# EasyEDA schematic SCH_sensors_2026-05-03.json

## Sheets
1 esp32: TITLE: Sheet_1; REV: 1.0; Date: 2026-04-29; Sheet: 1/1; Drawn By: milenamayilyan5; Company: Your Company
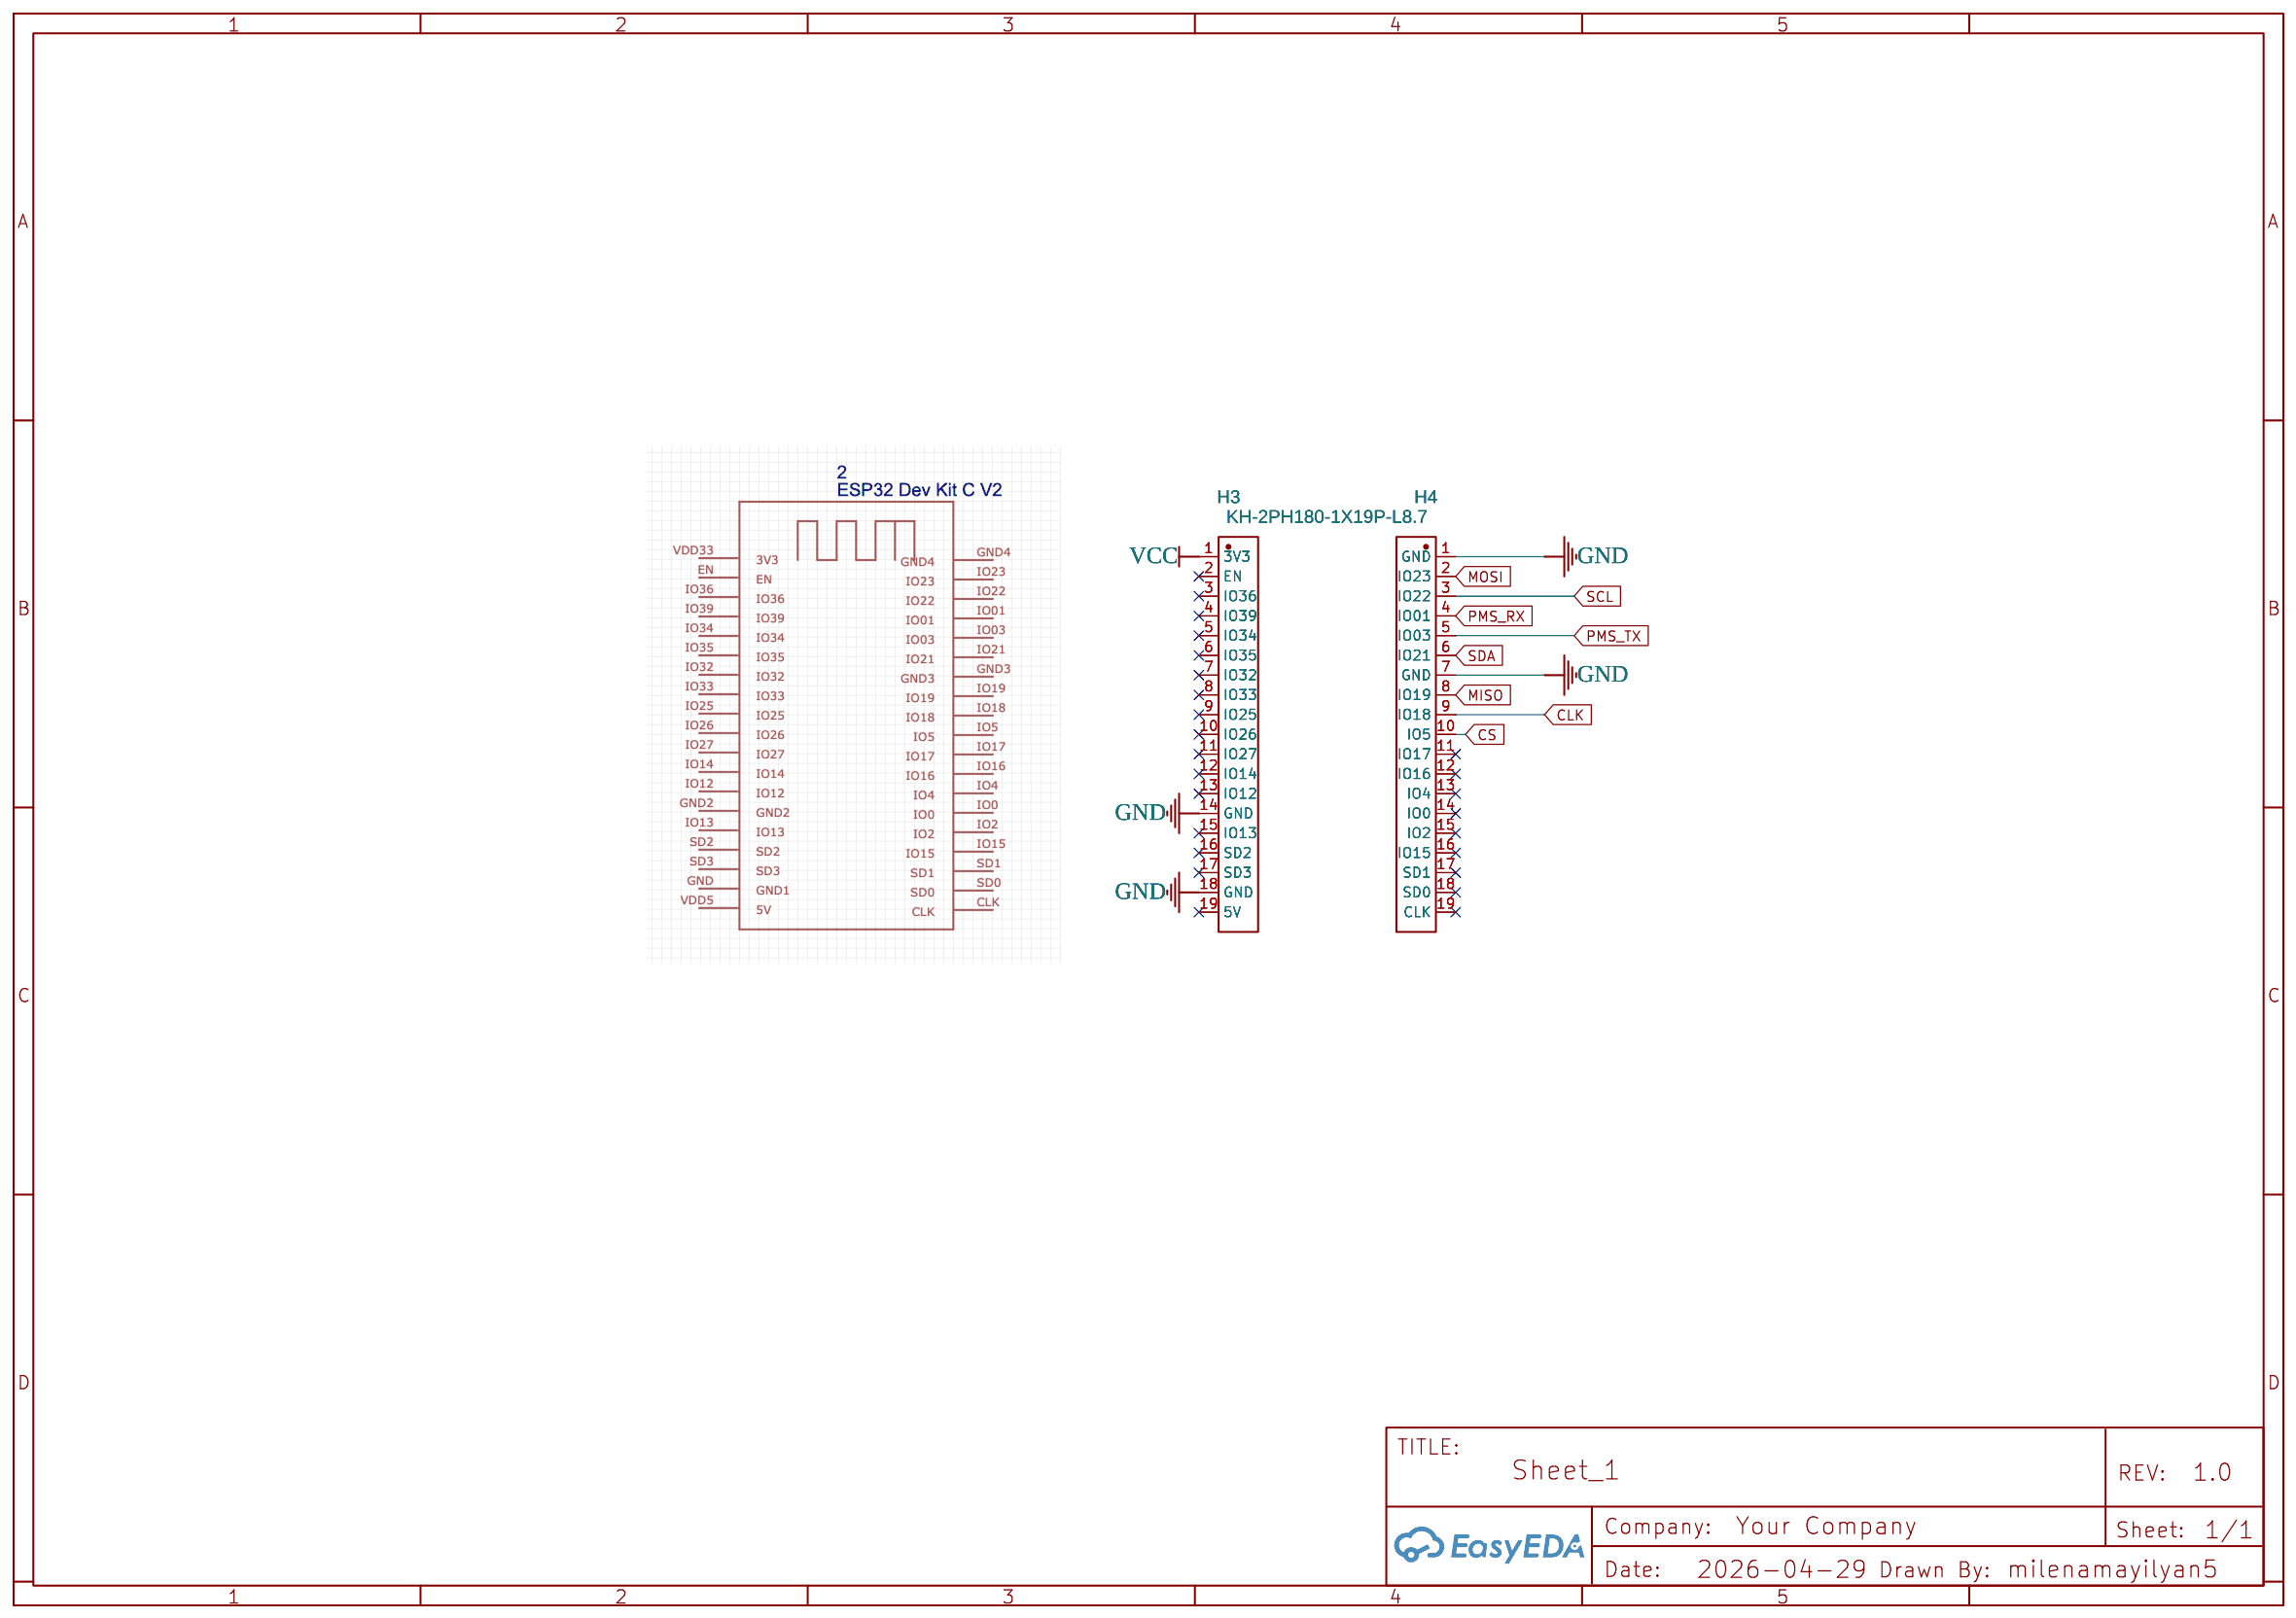
[diagram p0: esp32]
2 booster: TITLE: Sheet_2; Date: 2026-05-03
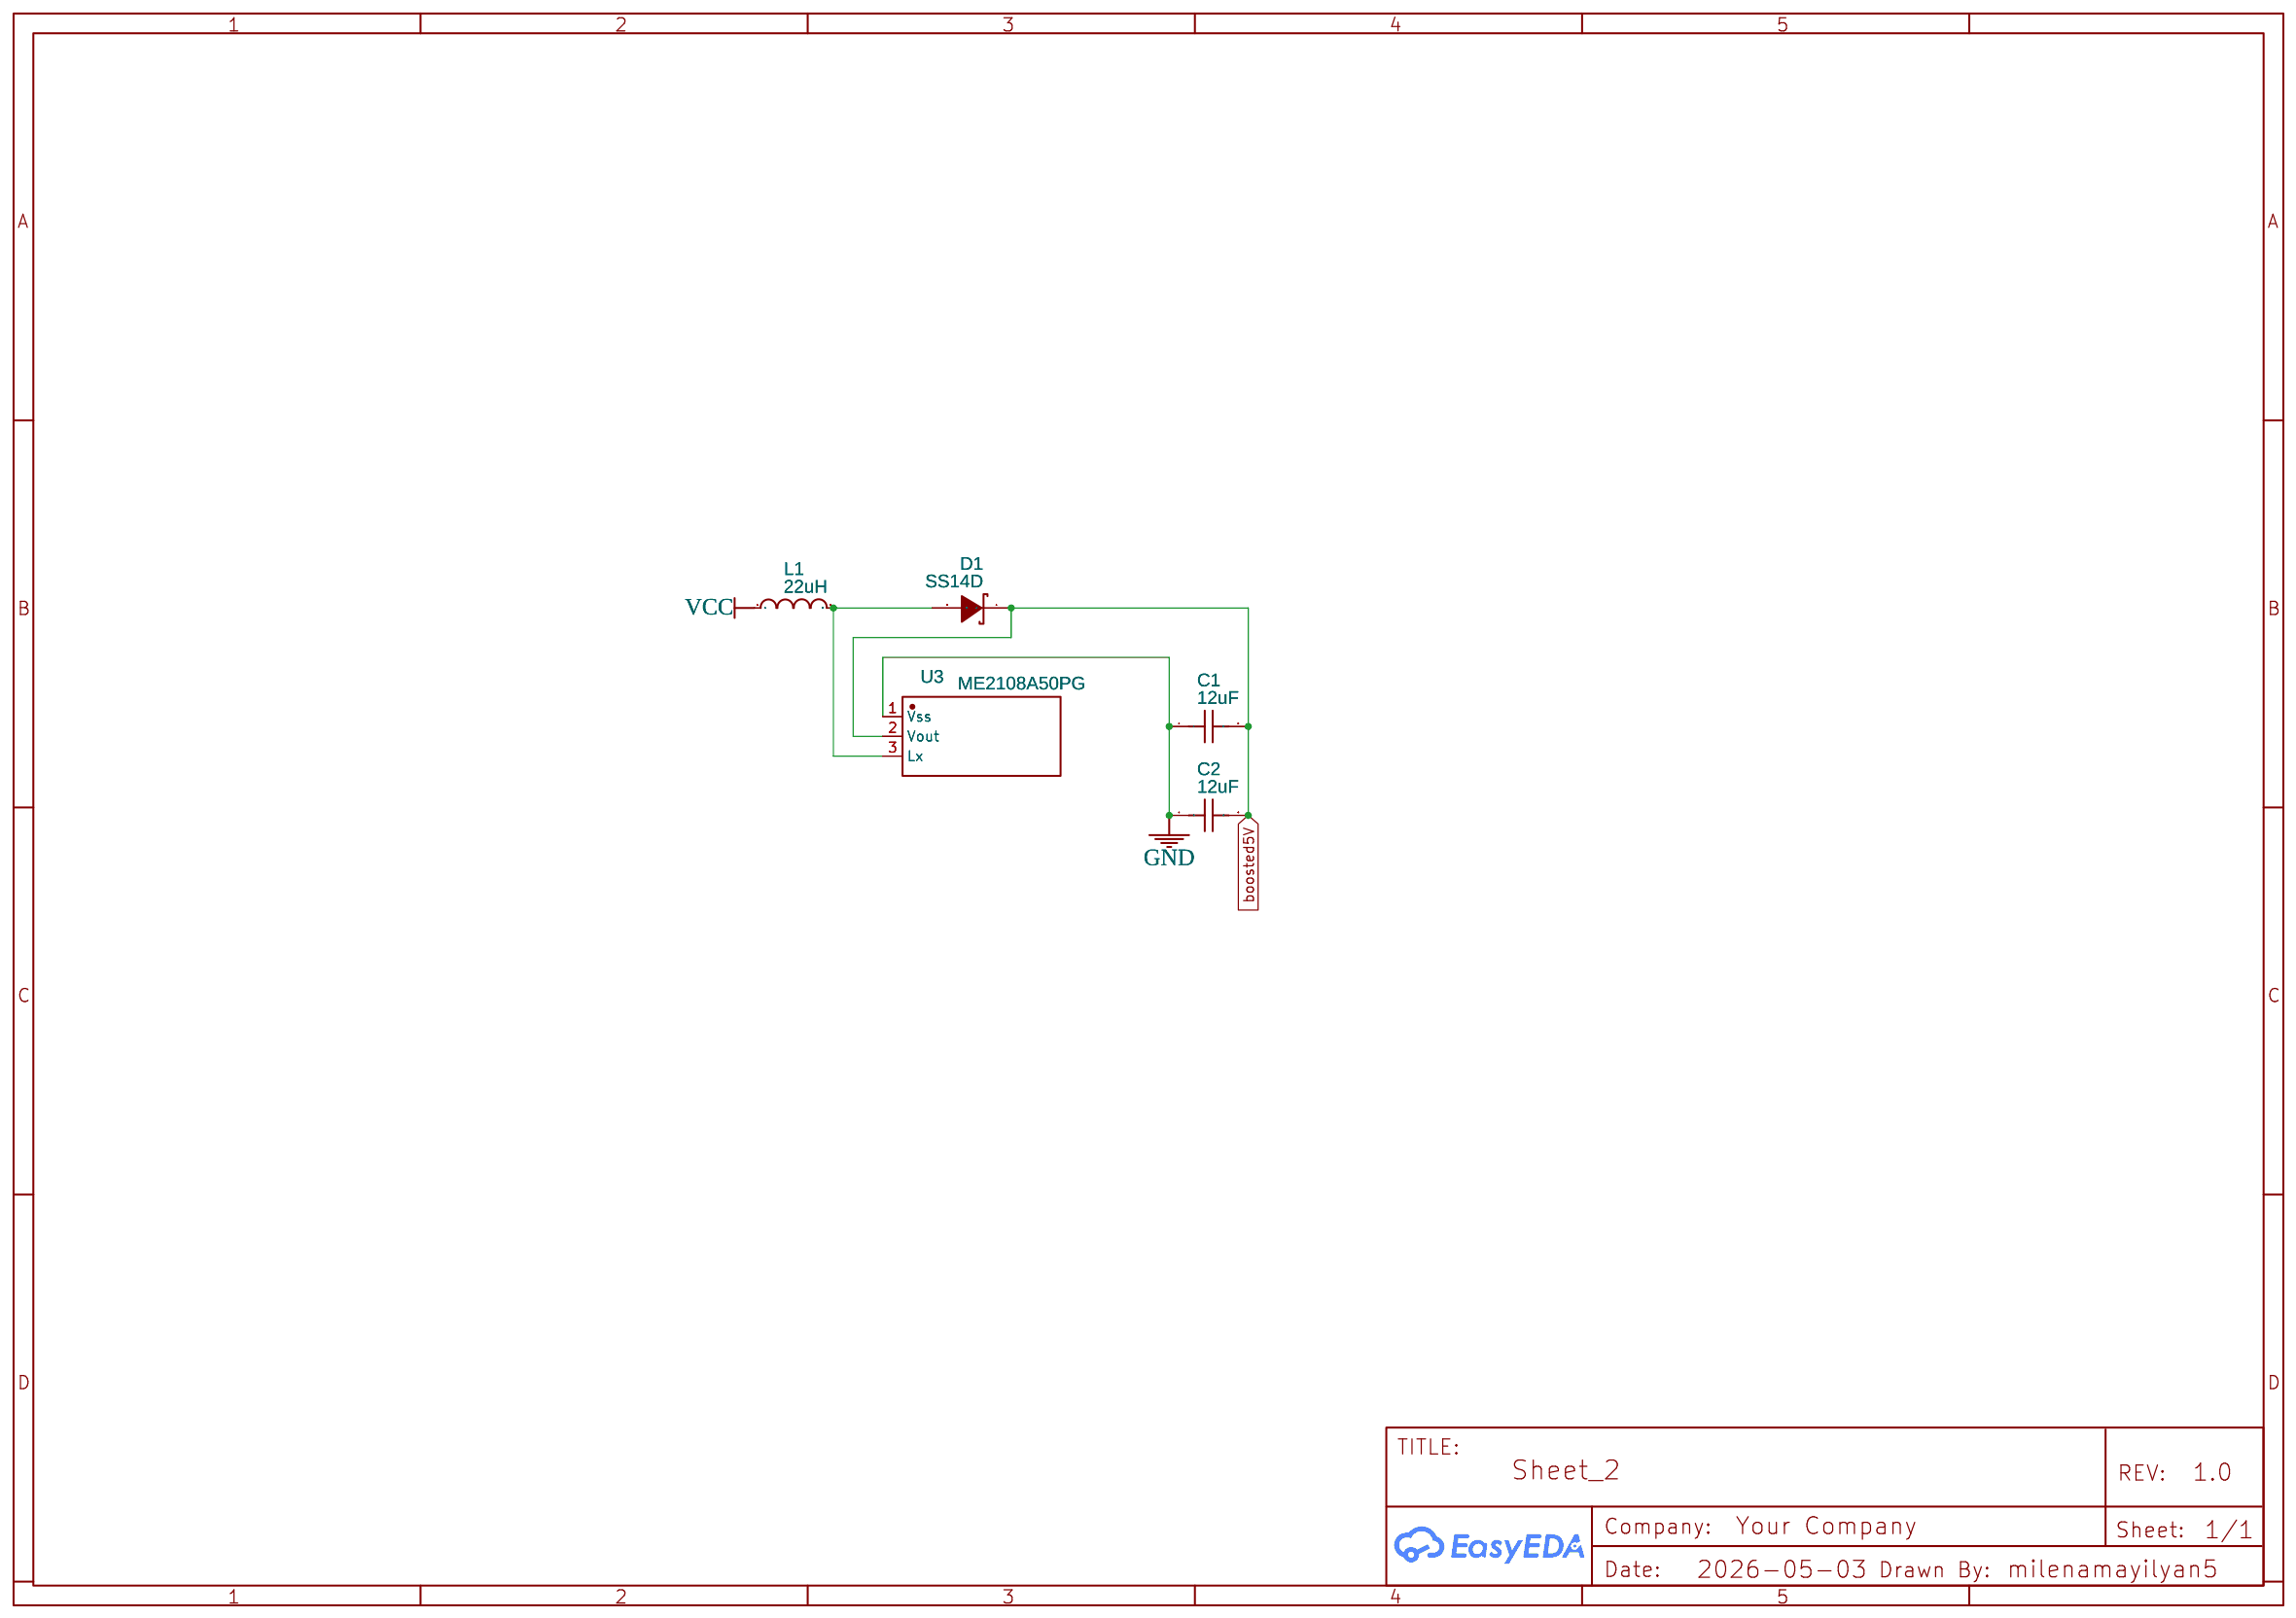
[diagram p1: booster]
3 sensors: TITLE: Sheet_2; Date: 2026-05-03
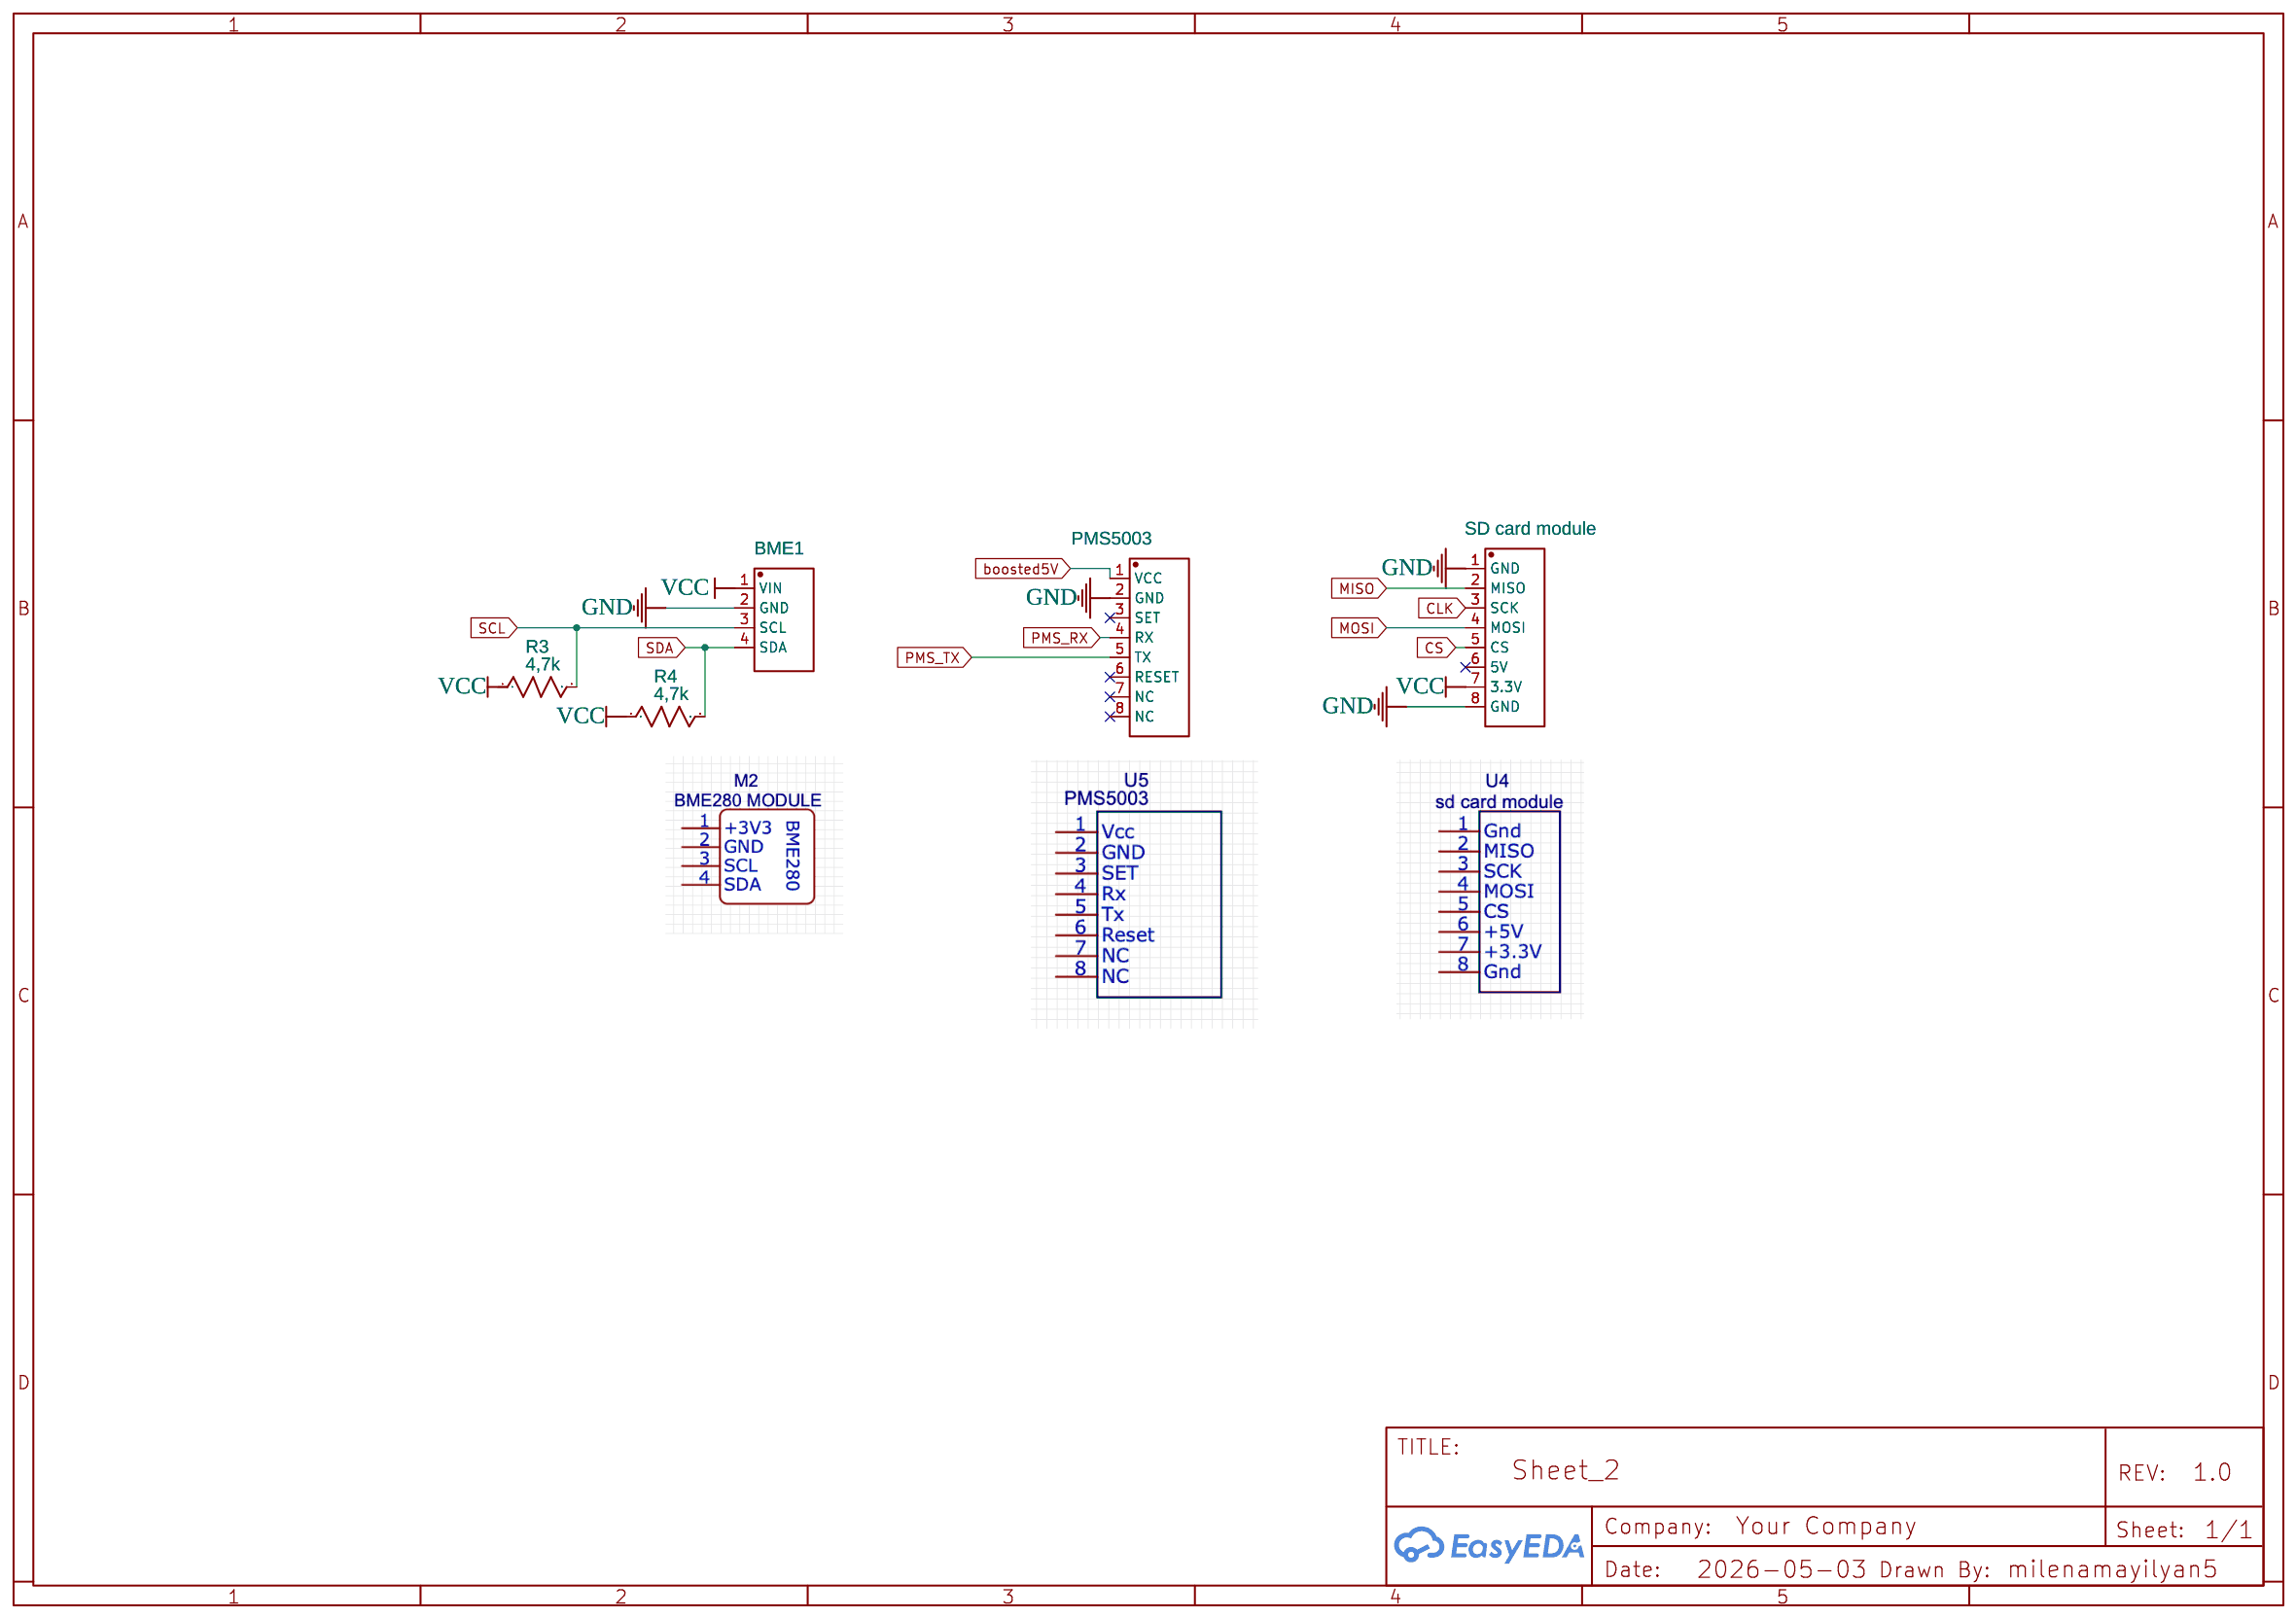
[diagram p2: sensors]

## Parts
sheet booster
C1  12uF  [C0603]
C2  12uF  [C0603]
D1  SS14D  [SMA_L4.4-W2.6-LS5.0-RD]
L1  22uH  [L0603]
U3  ME2108A50PG  [SOT-89-3_L4.5-W2.5-P1.50-LS4.2-BR]
sheet esp32
H3  KH-2PH180-1X19P-L8.7  [HDR-TH_KH-2PH180-1X19P-L8.7]
H4  KH-2PH180-1X19P-L8.7  [HDR-TH_KH-2PH180-1X19P-L8.7]
sheet sensors
BME1  I2C RAIL COPY  [HEADER - HEADER-FEMALE-2.54_1X4]
H5  SD card module  [HEADER-HEADER-FEMALE-2.54_1X8 SCU]
H6  PMS5003  [HEADER-HEADER-FEMALE-2.54_1X8 SCU]
R3  4,7k  [R0603]
R4  4,7k  [R0603]

## Library data of the parts
C1 C2 = C_0603_US: Contributor: LCEDA_Lib
D1 = SS14D: Supplier: LCSC; Manufacturer: ST(先科); Supplier Part: C83912; JLCPCB Part Class: Extended Part
L1 = L0603_US: Contributor: LCEDA_Lib
U3 = ME2108A50PG: Contributor: LCSC; Supplier: LCSC; Supplier Part: C236798; Manufacturer: MICRONE(南京微盟); JLCPCB Part Class: Extended Part
H3 H4 = KH-2PH180-1X19P-L8.7: Supplier: LCSC; Supplier Part: C20610450; Manufacturer: kinghelm(金航标); JLCPCB Part Class: Extended Part; Contributor: lcsc
BME1 = I2C RAIL COPY: Contributor: chrisrisse; Supplier: Sparkfun
H5 H6 = PIN HEADER 2.54 1X8 SCU: Supplier: Private; Contributor: Jo B
R3 R4 = R_0603_US: Contributor: LCEDA_Lib

## Nets
GND: BME1.2(GND) C1.1 C2.1 H3.14(GND) H3.18(GND) H4.1(GND) H4.7(GND) H5.1(GND) H5.8(GND) H6.2(GND) U3.1(Vss)
VCC: BME1.1(VIN) H3.1(3V3) H5.7(3.3V) L1.1 R3.1 R4.1
boosted5V: C1.2 C2.2 D1.1(K) H6.1(VCC) U3.2(Vout)
CLK: H4.9(IO18) H5.3(SCK)
CS: H4.10(IO5) H5.5(CS)
MISO: H4.8(IO19) H5.2(MISO)
MOSI: H4.2(IO23) H5.4(MOSI)
PMS_RX: H4.4(IO01) H6.4(RX)
PMS_TX: H4.5(IO03) H6.5(TX)
SCL: BME1.3(SCL) H4.3(IO22) R3.2
SDA: BME1.4(SDA) H4.6(IO21) R4.2
Net-(D1-2): D1.2(A) L1.2 U3.3(Lx)

Not connected (* = marked no-connect by the designer): H3 2(EN)* 3(IO36)* 4(IO39)* 5(IO34)* 6(IO35)* 7(IO32)* 8(IO33)* 9(IO25)* 10(IO26)* 11(IO27)* 12(IO14)* 13(IO12)* 15(IO13)* 16(SD2)* 17(SD3)* 19(5V)*; H4 11(IO17)* 12(IO16)* 13(IO4)* 14(IO0)* 15(IO2)* 16(IO15)* 17(SD1)* 18(SD0)* 19(CLK)*; H5 6(5V)*; H6 3(SET)* 6(RESET)* 7(NC)* 8(NC)*
